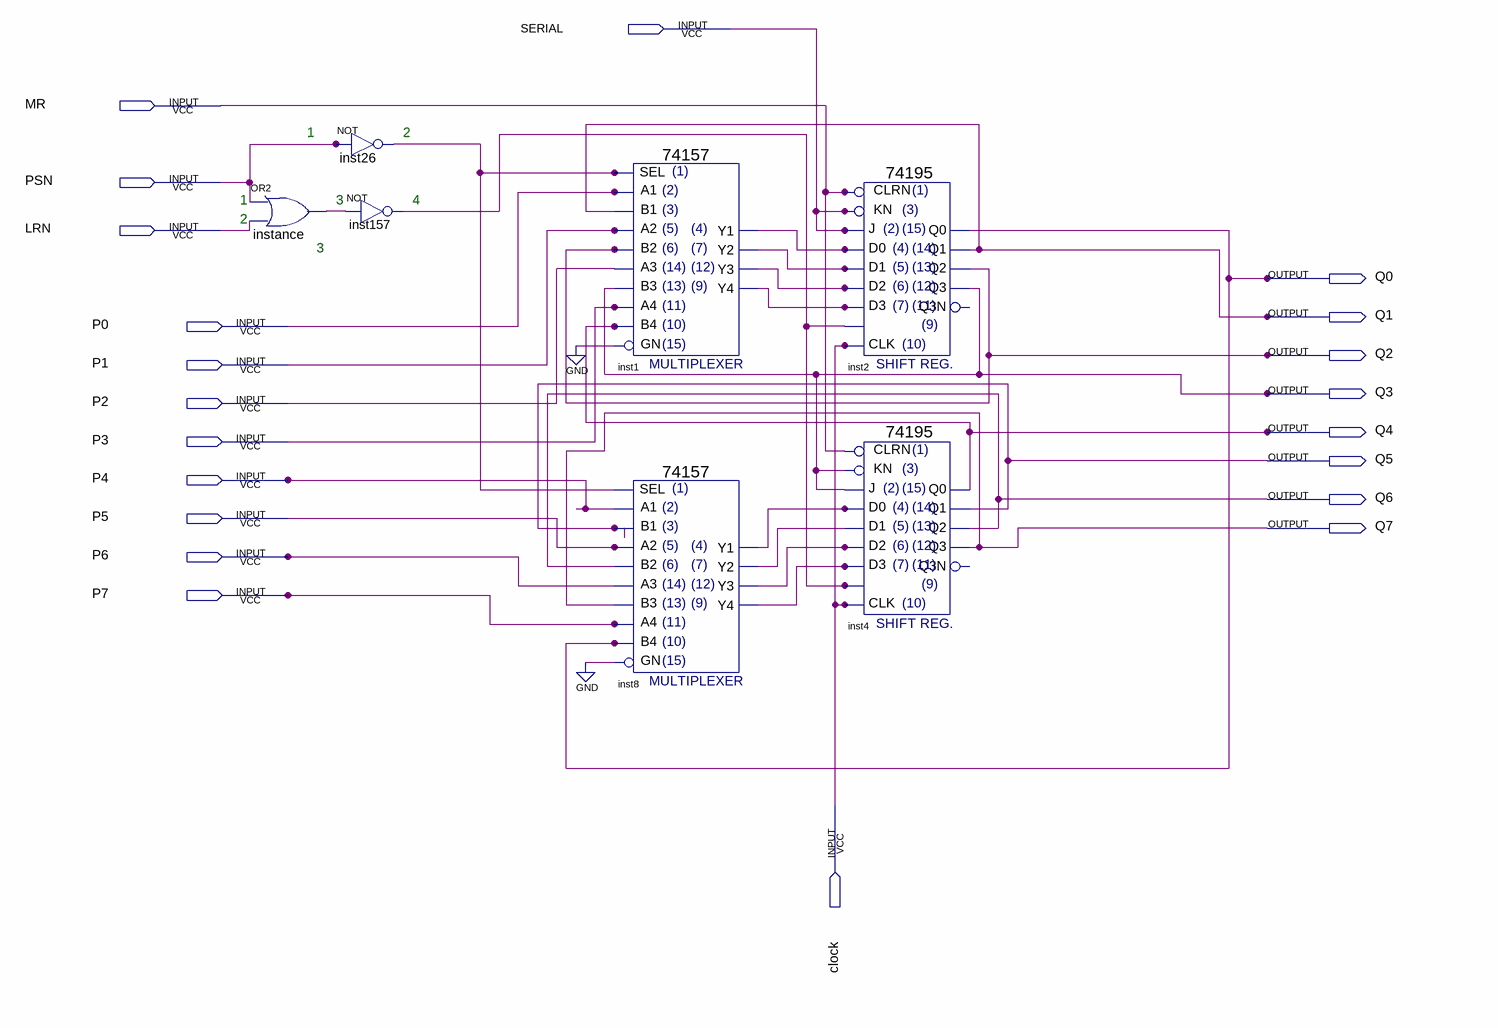
[diagram p0: schematic sheet]
// Quartus schematic p1.bdf as structural Verilog: 7 symbols, 21 pins
module p1 (
  input  SERIAL,
  input  MR,
  input  PSN,
  input  LRN,
  input  P0,
  input  P1,
  input  P2,
  input  P3,
  input  P4,
  input  P5,
  input  P6,
  input  P7,
  input  clock,
  output Q0,
  output Q1,
  output Q2,
  output Q3,
  output Q4,
  output Q5,
  output Q6,
  output Q7
);

  wire inst1_y1, inst1_y2, inst1_y3, inst1_y4, inst8_y1, inst8_y2, inst8_y3, inst8_y4, inst26_out,
       inst157_out, instance_out;

  or \instance  (instance_out, PSN, LRN);
  not inst26 (inst26_out, PSN);
  not inst157 (inst157_out, instance_out);
  \74157  inst1 (
    .A1(P0), .B1(Q1), .SEL(inst26_out), .B2(Q2), .A3(P2), .B3(Q3), .A2(P1), .B4(Q4), .GN(1'b0), .A4(P3),
    .Y2(inst1_y2), .Y1(inst1_y1), .Y4(inst1_y4), .Y3(inst1_y3));
  \74157  inst8 (
    .A1(P4), .B1(Q5), .SEL(inst26_out), .B2(Q6), .A3(P6), .B3(Q7), .A2(P5), .B4(Q0), .GN(1'b0), .A4(P7),
    .Y2(inst8_y2), .Y1(inst8_y1), .Y4(inst8_y4), .Y3(inst8_y3));
  \74195  inst2 (
    .D2(inst1_y3), .D1(inst1_y2), .D0(inst1_y1), .J(SERIAL), .CLK(clock), .D3(inst1_y4), .CLRN(MR),
    .KN(SERIAL), .\ST/LDN (inst157_out), .Q3(Q3), .Q0(Q0), .Q1(Q1), .Q2(Q2));  // open: Q3N
  \74195  inst4 (
    .D2(inst8_y3), .D1(inst8_y2), .D0(inst8_y1), .J(Q3), .CLK(clock), .D3(inst8_y4), .CLRN(MR), .KN(Q3),
    .\ST/LDN (inst157_out), .Q3(Q7), .Q0(Q4), .Q1(Q5), .Q2(Q6));  // open: Q3N

  // Notes on the sheet:
  //   1
  //   2
  //   1
  //   3
  //   4
  //   2
  //   3
endmodule
